# Altium schematic sheet RF EC25.SchDoc
size B; SheetNumber: 8; SheetTotal: 9
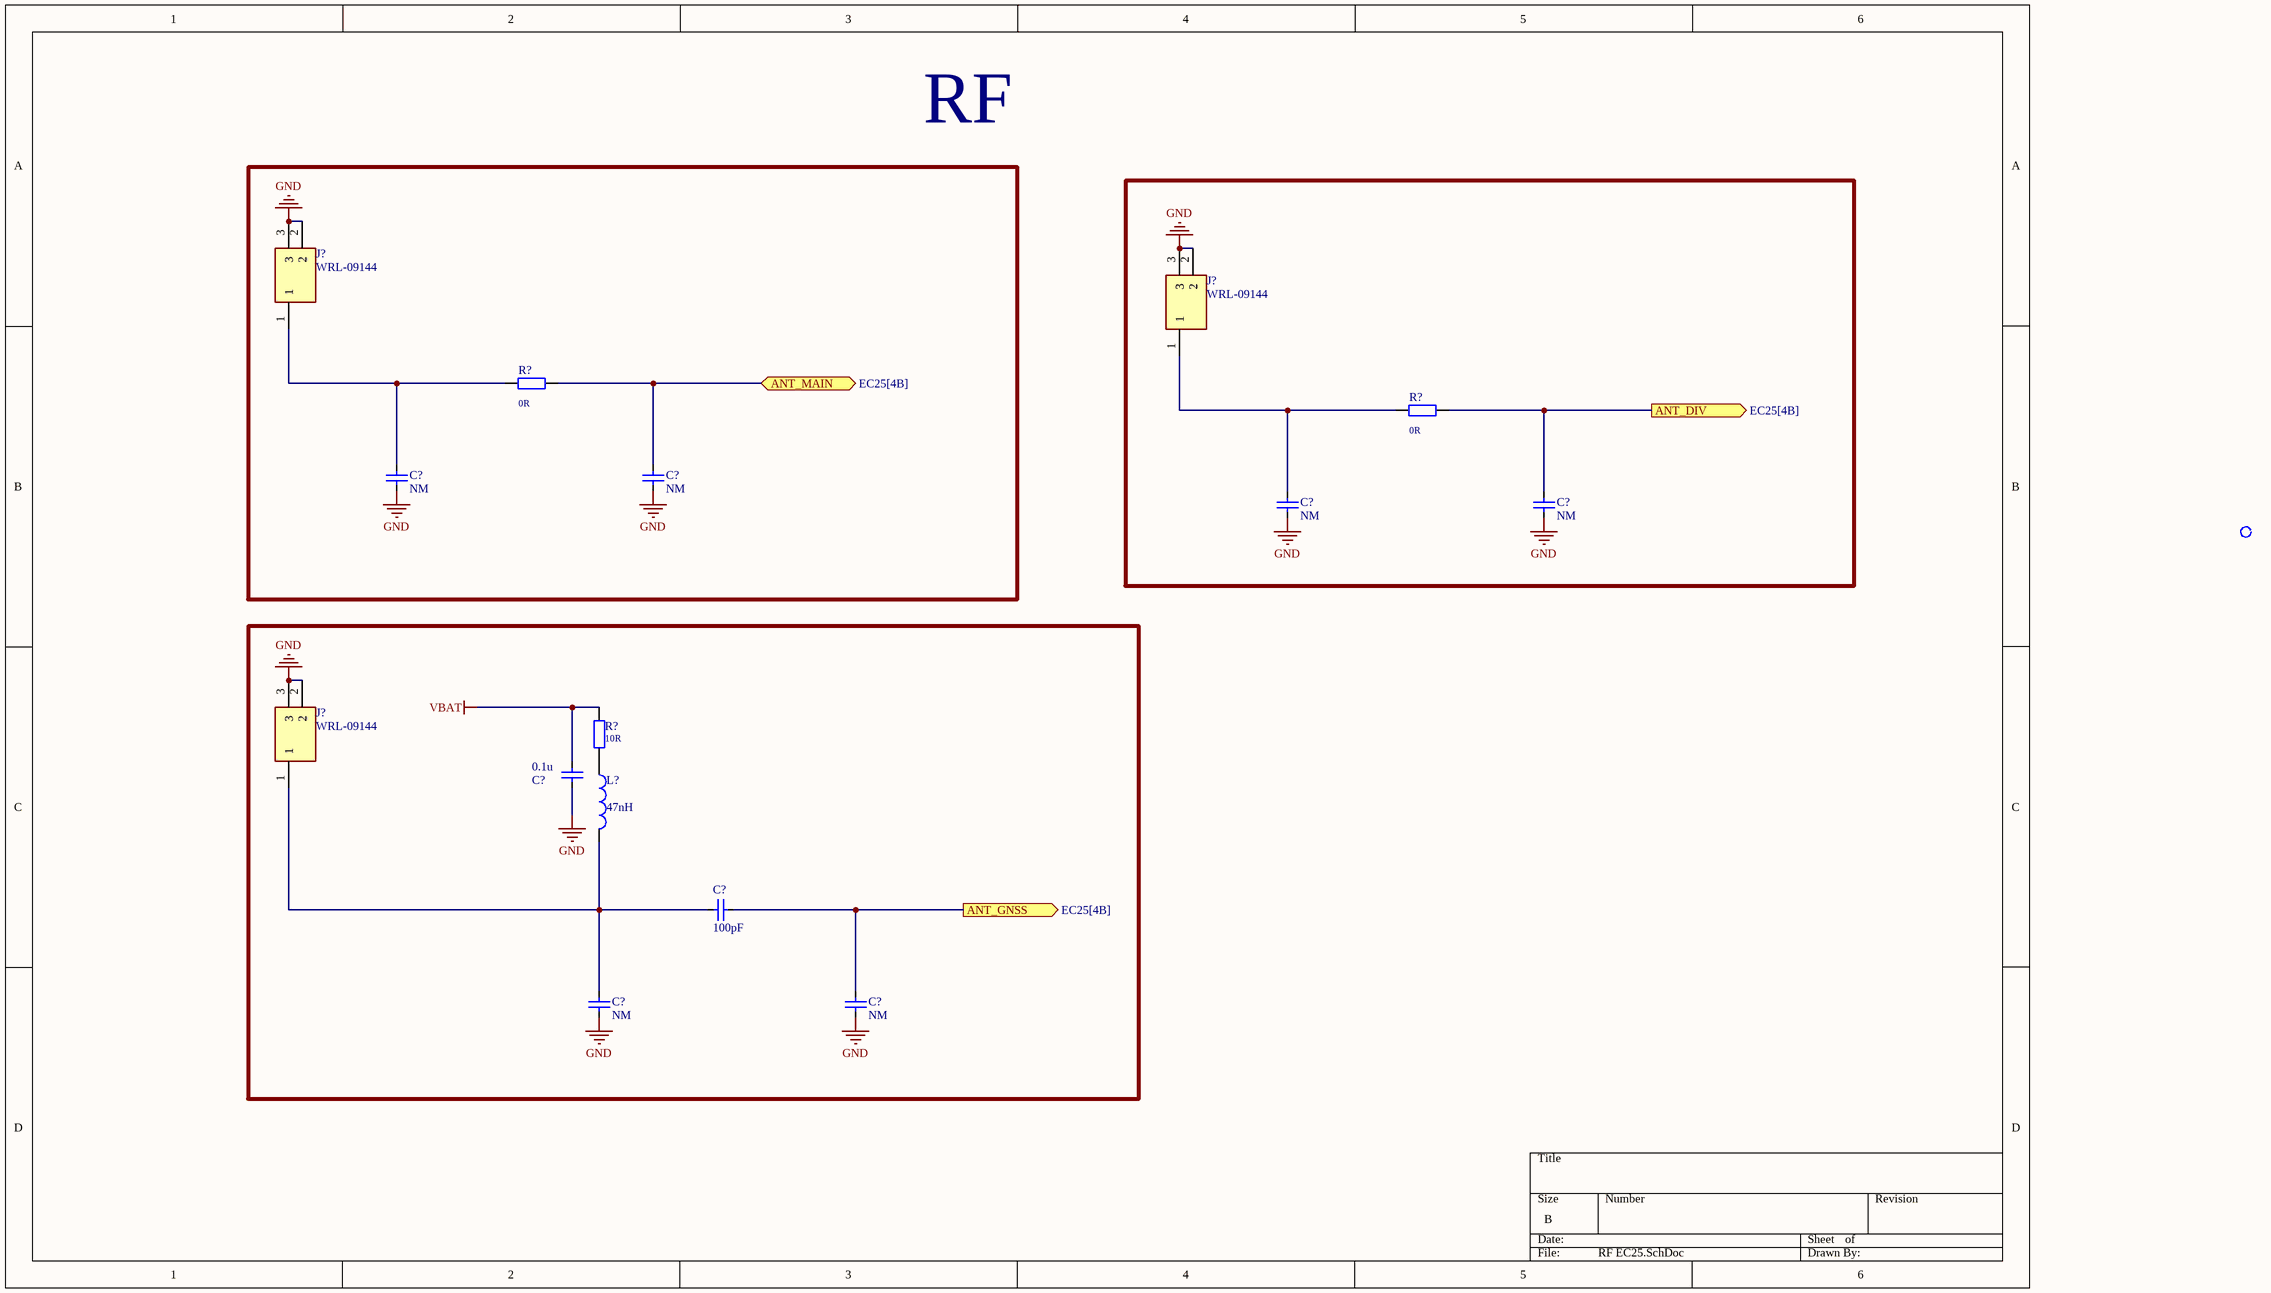
[diagram p0: RF EC25.SchDoc]

## Parts
(Parts that share a designator on the sheet are numbered #1, #2 ... from top to bottom, then left to right.)
C?#1  value NM  [CAPC1005X06N]  (hidden comment: C)
C?#2  value NM  [CAPC1005X06N]  (hidden comment: C)
C?#3  value NM  [CAPC1005X06N]  (hidden comment: C)
C?#4  value NM  [CAPC1005X06N]  (hidden comment: C)
C?#5  value 0.1u  [CAPC1005X06N]  (hidden comment: C)
C?#6  value 100pF  [CAPC1005X06N]  (hidden comment: C)
C?#7  value NM  [CAPC1005X06N]  (hidden comment: C)
C?#8  value NM  [CAPC1005X06N]  (hidden comment: C)
J?#1  WRL-09144  [WRL09144]
J?#2  WRL-09144  [WRL09144]
J?#3  WRL-09144  [WRL09144]
L?  value 47nH  [INDP6060X57N]  (hidden comment: L)
R?#1  value 0R  [RESC1005X04N]  (hidden comment: R)
R?#2  value 0R  [RESC1005X04N]  (hidden comment: R)
R?#3  value 10R  [RESC1005X04N]  (hidden comment: R)

## Ports
ANT_DIV (out, see EC25[4B]), ANT_GNSS (out, see EC25[4B]), ANT_MAIN (bidir, see EC25[4B])

## Nets
GND: C?#1.1 C?#2.1 C?#3.1 C?#4.1 C?#5.2 C?#7.1 C?#8.1 J?#1.2 J?#1.3 J?#2.2 J?#2.3 J?#3.2 J?#3.3
VBAT: C?#5.1 R?#3.2
ANT_DIV: C?#4.2 R?#2.2 ; port ANT_DIV
ANT_GNSS: C?#6.1 C?#8.2 ; port ANT_GNSS
ANT_MAIN: C?#2.2 R?#1.2 ; port ANT_MAIN
NetC?#1_2: C?#1.2 J?#1.1 R?#1.1
NetC?#3_2: C?#3.2 J?#2.1 R?#2.1
NetC?#6_2: C?#6.2 C?#7.2 J?#3.1 L?.2
NetL?_1: L?.1 R?#3.1

## Notes on the sheet
- RF

## Library data of the parts
J?#1-J?#3 = WRL-09144: Connector; Manufacturer_Name: SparkFun; Datasheet Link: http://cdn.sparkfun.com/datasheets/Wireless/Antennas/RF-001001.pdf; Height: 2.35mm; Manufacturer_Part_Number: WRL-09144; Mouser Part Number: 474-WRL-09144; Mouser Price/Stock: https://www.mouser.co.uk/ProductDetail/SparkFun/WRL-09144/?qs=WyAARYrbSnY0QxfAwjKRnw%3D%3D; Arrow Part Number: WRL-09144; Arrow Price/Stock: https://www.arrow.com/en/products/wrl-09144/sparkfun-electronics
C?#1-C?#8 = C: MPN: *; Link: *
L? = L: MPN: *; Link: *
R?#1-R?#3 = R: MPN: *; Link: *